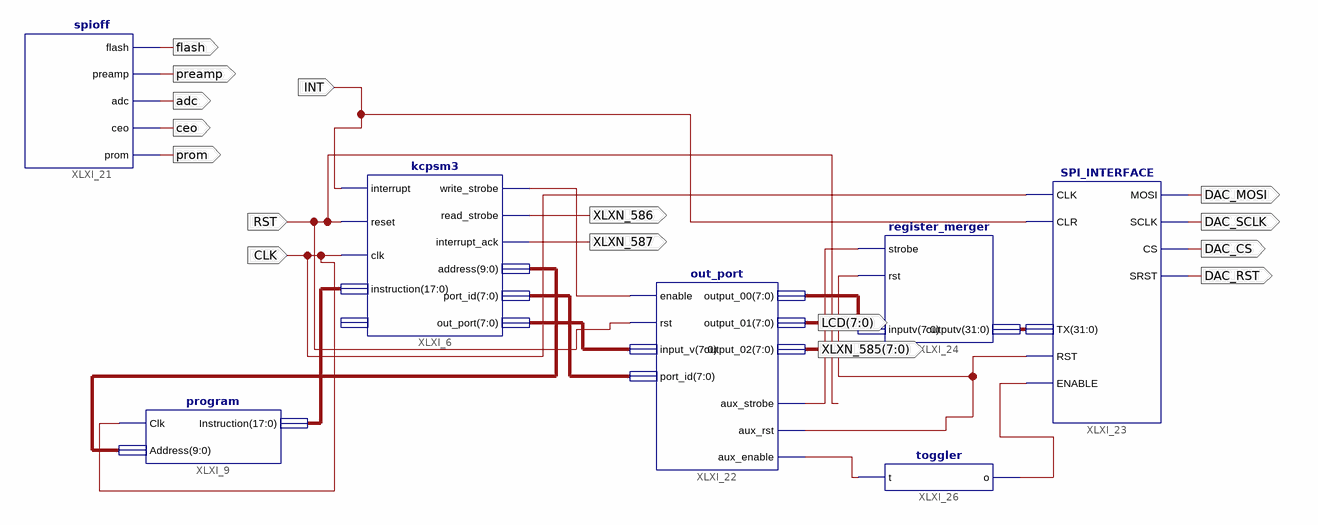
[diagram p0: schematic sheet 1]
// Xilinx ISE schematic todo.sch (spartan3e) as structural Verilog: 7 symbols, 16 ports
module todo (
  input  INT,
  input  RST,
  input  CLK,
  output DAC_CS,
  output DAC_MOSI,
  output DAC_SCLK,
  output DAC_RST,
  output flash,
  output preamp,
  output adc,
  output ceo,
  output prom,
  output [7:0] LCD,
  output [7:0] XLXN_585,
  output XLXN_586,
  output XLXN_587
);

  wire register_strobe, spi_enable, spi_reset, x567, XLXN_553;
  wire [7:0] XLXN_554, XLXN_555, XLXN_564;
  wire [9:0] XLXN_15;
  wire [17:0] XLXN_14;
  wire [31:0] XLXN_557;

  kcpsm3 XLXI_6 (
    .interrupt(INT), .reset(RST), .clk(CLK), .instruction(XLXN_14), .write_strobe(XLXN_553),
    .read_strobe(XLXN_586), .interrupt_ack(XLXN_587), .address(XLXN_15), .port_id(XLXN_555),
    .out_port(XLXN_554));  // open: in_port
  \program  XLXI_9 (.Clk(CLK), .Address(XLXN_15), .Instruction(XLXN_14));
  out_port XLXI_22 (
    .enable(XLXN_553), .rst(RST), .input_v(XLXN_554), .port_id(XLXN_555), .aux_strobe(register_strobe),
    .output_00(XLXN_564), .output_01(LCD), .output_02(XLXN_585), .aux_rst(spi_reset), .aux_enable(x567));
  SPI_INTERFACE XLXI_23 (
    .RST(spi_reset), .ENABLE(spi_enable), .CLK(CLK), .CLR(INT), .TX(XLXN_557), .MOSI(DAC_MOSI),
    .SCLK(DAC_SCLK), .CS(DAC_CS), .SRST(DAC_RST));
  register_merger XLXI_24 (.strobe(register_strobe), .rst(spi_reset), .inputv(XLXN_564), .outputv(XLXN_557));
  toggler XLXI_26 (.t(x567), .o(spi_enable));
  spioff XLXI_21 (.flash(flash), .preamp(preamp), .adc(adc), .ceo(ceo), .prom(prom));
endmodule
